# Altium project battery_shield.PrjPcb
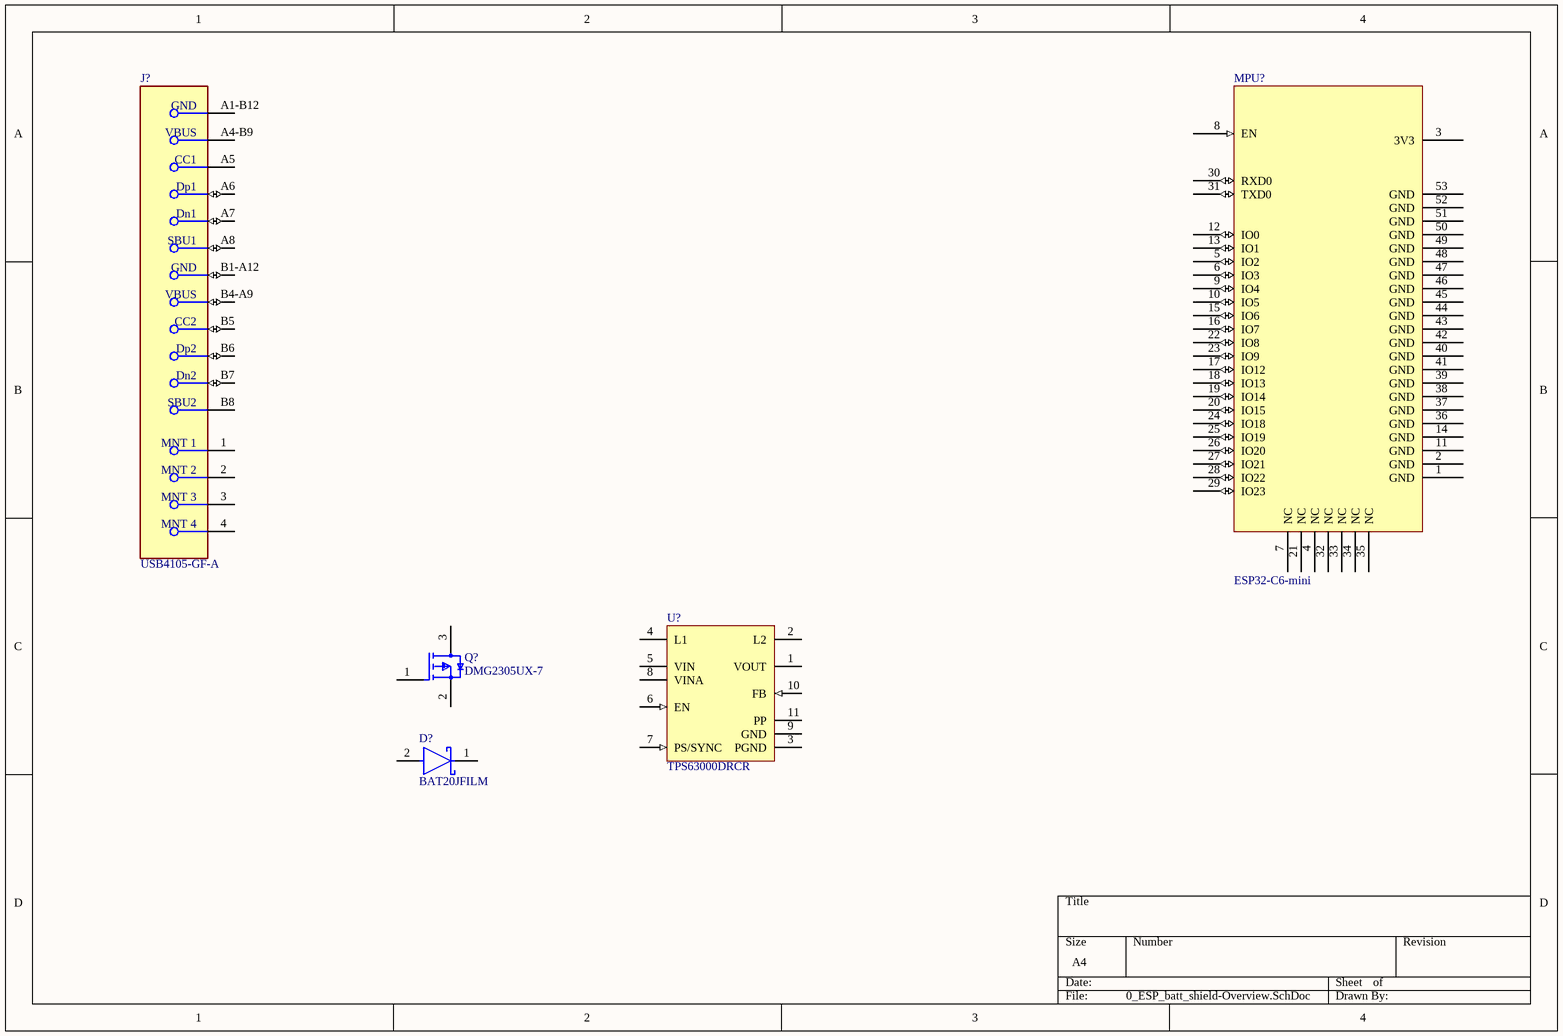
[diagram p0: 0_ESP_batt_shield-Overview.SchDoc]
3 sheets, 19 parts. Net scope: flat (ports and power ports of the same name join across sheets).
Board file: PCB1.PcbDoc
Sheets:
  0_ESP_batt_shield-Overview.SchDoc
  1_ESP_batt_shield-Power.SchDoc
  2_ESP_batt_shield-MCU_and_sensors.SchDoc

## Sheet 0_ESP_batt_shield-Overview.SchDoc
size A4; SheetNumber: 1; SheetTotal: 1

### Parts
(Parts that share a designator on the sheet are numbered #1, #2 ... from top to bottom, then left to right.)
D?  BAT20JFILM  [FP-BAT20JFILM-MFG]
J?  USB4105-GF-A  [FP-USB4105-GF-A-MFG]
MPU?#1  ESP32-C6-mini  [ESP32C6_MINI]
Q?  DMG2305UX-7  [FP-SOT23-IPC_B]
U?  TPS63000DRCR  [DRC0010J_V]

### Nets

Not connected (* = marked no-connect by the designer): D? 1(K) 2(A); J? 1(MNT_1) 2(MNT_2) 3(MNT_3) 4(MNT_4) A1-B12(GND) A4-B9(VBUS) A5(CC1) A6(Dp1) A7(Dn1) A8(SBU1) B1-A12(GND) B4-A9(VBUS) B5(CC2) B6(Dp2) B7(Dn2) B8(SBU2); MPU?#1 1(GND) 2(GND) 3(3V3) 4(NC) 5(IO2) 6(IO3) 7(NC) 8(EN) 9(IO4) 10(IO5) 11(GND) 12(IO0) 13(IO1) 14(GND) 15(IO6) 16(IO7) 17(IO12) 18(IO13) 19(IO14) 20(IO15) 21(NC) 22(IO8) 23(IO9) 24(IO18) 25(IO19) 26(IO20) 27(IO21) 28(IO22) 29(IO23) 30(RXD0) 31(TXD0) 32(NC) 33(NC) 34(NC) 35(NC) 36(GND) 37(GND) 38(GND) 39(GND) 40(GND) 41(GND) 42(GND) 43(GND) 44(GND) 45(GND) 46(GND) 47(GND) 48(GND) 49(GND) 50(GND) 51(GND) 52(GND) 53(GND); Q? 1(GATE) 2(SOURCE) 3(DRAIN); U? 1(VOUT) 2(L2) 3(PGND) 4(L1) 5(VIN) 6(EN) 7(PS/SYNC) 8(VINA) 9(GND) 10(FB) 11(PP)

### Library data of the parts
D? = CMP-12187-000030-1: DIODE SCHOTTKY 23V 1A SOD323; Polarity: Standard; Element Configuration: Single; Capacitance: 30pF; Forward Voltage: 620mV; Max Surge Current: 5A; Peak Reverse Current: 12uA; Packaging: Tape and Reel; Weight: 0.01lb; Output Current: 1A; Lead Free: Lead Free; Forward Current: 1A; Mount: Surface Mount; Max Reverse Voltage (DC): 23V; Average Rectified Current: 1A; Max Operating Temperature: 150°C; Max Forward Surge Current (Ifsm): 5A; REACH SVHC: No SVHC; Current Rating: 1A; Length: 1.8mm; Radiation Hardening: No; Max Reverse Leakage Current: 12uA; Voltage Rating (DC): 23V; Height: 1.03mm; Peak Non-Repetitive Surge Current: 5A; Max Repetitive Reverse Voltage (Vrrm): 23V; Min Operating Temperature: -65°C; Number of Pins: 2; Width: 1.35mm; Package Quantity: 1
J? = CMP-245163-000001-1: CONN RCPT USB2.0 TYPEC 5A; Manufacturer: GCT; Voltage Rating: 20V; Is Female: yes; Current Rating: 5/6.25/1.25/0.25A; Number Of Contacts: 16; Conn Orientation: Right Angle; Device Class L1: Connectors; Category: Conn; Lead Free: Yes; RoHS: TRUE; Temperature Range High: +85°C; Digikey Description: CONN RCPT USB2.0 TYPEC 5A; Device Class L3: unset; ComponentLink2Description: Datasheet; Manufacturer Part Number: USB4105-GF-A; Package: 0; Usb Standard: USB 2.0; Device Class L2: USB Connectors; Automotive: No; Temperature Range Low: -40°C; Height: 3.46mm; Temperature: -40°C to +85°C; Contact Material: Gold,Nickel; ComponentLink2URL: https://gct.co/files/drawings/usb4105.pdf; Octopart: https://octopart.com/usb4105-gf-a-gct-106627878
Q? = CMP-1693-00002-4: MOSFET P-CH 20V 4.2A SOT23; Turn-On Delay Time: 10.8ns; Turn-Off Delay Time: 79.3ns; Threshold Voltage: -900mV; Rise Time: 13.7ns; Gate to Source Voltage (Vgs): 8V; Rds On Max: 52mR; Element Configuration: Single; Fall Time: 34.7ns; Max Power Dissipation: 1.4W; Drain to Source Resistance: 200mR; Number of Channels: 1; Input Capacitance: 808pF; Lead Free: Lead Free; Number of Pins: 3; Length: 3mm; Continuous Drain Current (ID): 4.2A; Contact Plating: Tin; Mount: Surface Mount; Weight: 0.000282oz; Min Operating Temperature: -55°C; Package Quantity: 3000; Drain to Source Voltage (Vdss): 20V; On-State Resistance: 52MR; Max Operating Temperature: 150°C; Height: 1.1mm; REACH SVHC: No SVHC; Packaging: Tape and Reel; Radiation Hardening: No; Case/Package: SOT-23; Width: 1.4mm
U? = CMP-0345-00001-2: Buck-Boost Voltage Converter with 1.8 to 5.5 V Input and 1.2 to 5.5 V Output, -40 to 85 degC, 10-Pin SON (DRC), Green (RoHS & no Sb/Br); Manufacturer: Texas Instruments; Vout(Max)(V): 5.5; Synchronous Rectification: TRUE; SubFamily: Buck-Boost Regulator; Vin(Min)(V): 1.8; Iq(Typ)(mA): 0.04; Iout(Max)(A): 1.2; Regulated Outputs(#): 1; Switching Frequency(Max)(kHz): 1500; ComponentLink1Description: Datasheet; Mounting Technology: Surface Mount; DatasheetVersion: SLVS520B; Eco-Plan: Green (RoHS & no Sb/Br); PackageVersion: revL, Sep-2011; PackageDescription: 10-Pin Plastic Small Outline No-Lead, 3 x 3 x 1 mm Body, 0.5 mm Pitch, Exposed Pad; Vout(Min)(V): 1.2; Vin(Max)(V): 5.5; Topology: Buck-Boost; Dynamic Voltage Scaling: TRUE; ComponentLink1URL: http://www.ti.com/general/docs/lit/getliterature.tsp?genericPartNumber=TPS63000&fileType=pdf; PartNumber: TPS63000DRCR; ComponentLink2URL: http://www.ti.com/litv/pdf/mpds117k; PackageReference: DRC0010J; ComponentLink2Description: Package Specification

## Sheet 1_ESP_batt_shield-Power.SchDoc
size A4; SheetNumber: 2; SheetTotal: 3
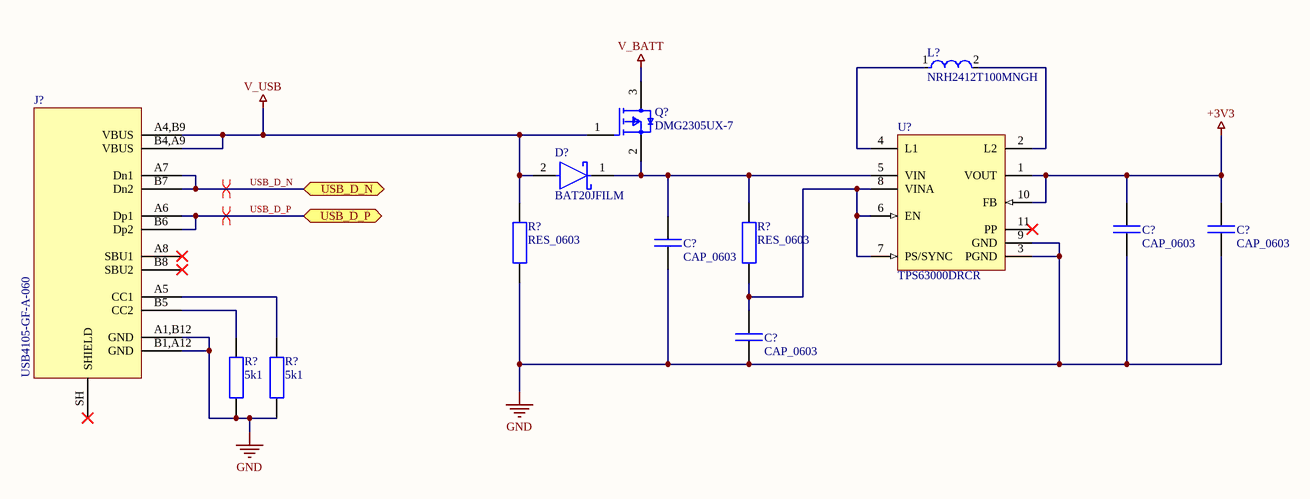
[diagram p1: 1_ESP_batt_shield-Power.SchDoc]

### Parts
C5  CAP_0603  [CAP_0603]
C6  CAP_0603  [CAP_0603]
C7  CAP_0603  [CAP_0603]
C8  CAP_0603  [CAP_0603]
D3  BAT20JFILM  [FP-BAT20JFILM-MFG]
J3  USB4105-GF-A-060  [GCT_USB4105-GF-A-060]
L1  NRH2412T100MNGH  [FP-NRH2412-MFG]
Q1  DMG2305UX-7  [FP-SOT23-IPC_B]
R2  RES_0603  [RES_0603]
R3  RES_0603  [RES_0603]
R4  5k1  [RES_0603]
R5  5k1  [RES_0603]
U1  TPS63000DRCR  [DRC0010J_V]

### Ports
USB_D_N (bidir), USB_D_P (bidir)

### Nets
+3V3: C5.2 C6.2 U1.1(VOUT) U1.10(FB)
GND: C5.1 C6.1 C7.1 C8.1 J3.A1,B12(GND) J3.B1,A12(GND) R2.1 R4.1 R5.1 U1.3(PGND) U1.9(GND)
V_BATT: Q1.3(DRAIN)
V_USB: D3.2(A) J3.A4,B9(VBUS) J3.B4,A9(VBUS) Q1.1(GATE) R2.2
USB_D_N: J3.A7(Dn1) J3.B7(Dn2) ; port USB_D_N
USB_D_P: J3.A6(Dp1) J3.B6(Dp2) ; port USB_D_P
NetC7_2: C7.2 D3.1(K) Q1.2(SOURCE) R3.2 U1.5(VIN)
NetC8_2: C8.2 R3.1 U1.6(EN) U1.7(PS/SYNC) U1.8(VINA)
NetJ3_A5: J3.A5(CC1) R5.2
NetJ3_B5: J3.B5(CC2) R4.2
NetL1_1: L1.1 U1.4(L1)
NetL1_2: L1.2 U1.2(L2)

Not connected (* = marked no-connect by the designer): J3 A8(SBU1)* B8(SBU2)* SH(SHIELD)*; U1 11(PP)*

### Layout directives
differential pair: USB_D_N, USB_D_P

### Notes on the sheet
- (in symbol USB4105-GF-A-060) USB-C connector

### Library data of the parts
D3 = CMP-12187-000030-1: as D? on sheet 0_ESP_batt_shield-Overview; Packaging: Tape and Reel; Weight: 0.01lb; Output Current: 1A; Lead Free: Lead Free; Forward Current: 1A; Mount: Surface Mount; Max Reverse Voltage (DC): 23V; Average Rectified Current: 1A; Max Operating Temperature: 150°C; Max Forward Surge Current (Ifsm): 5A; REACH SVHC: No SVHC; Current Rating: 1A; Length: 1.8mm; Radiation Hardening: No; Max Reverse Leakage Current: 12uA; Voltage Rating (DC): 23V; Height: 1.03mm; Peak Non-Repetitive Surge Current: 5A; Max Repetitive Reverse Voltage (Vrrm): 23V; Min Operating Temperature: -65°C; Number of Pins: 2; Width: 1.35mm; Package Quantity: 1
J3 = USB4105-GF-A-060: This is 16pin USB-C connector; pin to pad: A1,B12>A1_B12 A4,B9>A4_B9 B1,A12>B1_A12 B4,A9>B4_A9
L1 = CMP-14484-000582-1: Shielded Wirewound Inductor 10uH 20% 0.51A 0.72Ω SMD; DC Resistance (DCR): 600mR; Current Rating: 450mA; Saturation Current: 810mA; Core Material: Ferrite; Test Frequency: 100kHz; Self Resonant Frequency: 29MHz; Termination: SMD/SMT; Shielding: Shielded; Height - Seated (Max): 0.047inch; Case/Package: Nonstandard; Tolerance: 20%; Height: 1.2mm; Package Quantity: 2500; Mount: Surface Mount; Min Operating Temperature: -25°C; Inductance: 10uH; Width: 0.095inch; Length: 0.095inch; RoHS Compliant: Yes; Max DC Current: 810mA; Packaging: Tape and Reel; Max Operating Temperature: 120°C; Halogen Free: Halogen Free
Q1 = CMP-1693-00002-4: as Q? on sheet 0_ESP_batt_shield-Overview; Lead Free: Lead Free; Number of Pins: 3; Length: 3mm; Continuous Drain Current (ID): 4.2A; Contact Plating: Tin; Mount: Surface Mount; Weight: 0.000282oz; Min Operating Temperature: -55°C; Package Quantity: 3000; Drain to Source Voltage (Vdss): 20V; On-State Resistance: 52MR; Max Operating Temperature: 150°C; Height: 1.1mm; REACH SVHC: No SVHC; Packaging: Tape and Reel; Radiation Hardening: No; Case/Package: SOT-23; Width: 1.4mm
R4 R5 = RES_0603
U1 = CMP-0345-00001-2: as U? on sheet 0_ESP_batt_shield-Overview; ComponentLink1Description: Datasheet; Mounting Technology: Surface Mount; DatasheetVersion: SLVS520B; Eco-Plan: Green (RoHS & no Sb/Br); PackageVersion: revL, Sep-2011; PackageDescription: 10-Pin Plastic Small Outline No-Lead, 3 x 3 x 1 mm Body, 0.5 mm Pitch, Exposed Pad; Vout(Min)(V): 1.2; Vin(Max)(V): 5.5; Topology: Buck-Boost; Dynamic Voltage Scaling: TRUE; ComponentLink1URL: http://www.ti.com/general/docs/lit/getliterature.tsp?genericPartNumber=TPS63000&fileType=pdf; PartNumber: TPS63000DRCR; ComponentLink2URL: http://www.ti.com/litv/pdf/mpds117k; PackageReference: DRC0010J; ComponentLink2Description: Package Specification

## Sheet 2_ESP_batt_shield-MCU_and_sensors.SchDoc
size A4; SheetNumber: 3; SheetTotal: 3
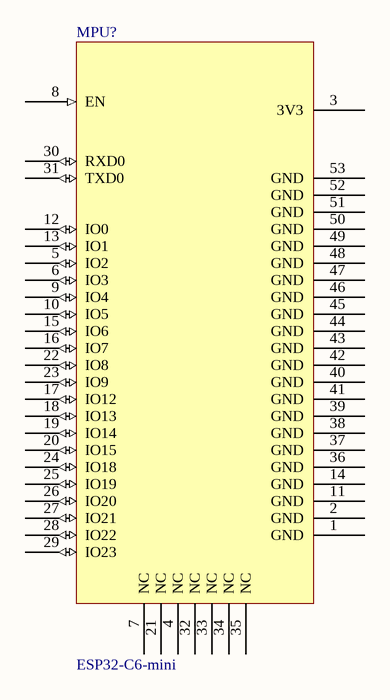
[diagram p2: 2_ESP_batt_shield-MCU_and_sensors.SchDoc]

### Parts
(Parts that share a designator on the sheet are numbered #1, #2 ... from top to bottom, then left to right.)
MPU?#2  ESP32-C6-mini  [ESP32C6_MINI]

### Nets

Not connected (* = marked no-connect by the designer): MPU?#2 1(GND) 2(GND) 3(3V3) 4(NC) 5(IO2) 6(IO3) 7(NC) 8(EN) 9(IO4) 10(IO5) 11(GND) 12(IO0) 13(IO1) 14(GND) 15(IO6) 16(IO7) 17(IO12) 18(IO13) 19(IO14) 20(IO15) 21(NC) 22(IO8) 23(IO9) 24(IO18) 25(IO19) 26(IO20) 27(IO21) 28(IO22) 29(IO23) 30(RXD0) 31(TXD0) 32(NC) 33(NC) 34(NC) 35(NC) 36(GND) 37(GND) 38(GND) 39(GND) 40(GND) 41(GND) 42(GND) 43(GND) 44(GND) 45(GND) 46(GND) 47(GND) 48(GND) 49(GND) 50(GND) 51(GND) 52(GND) 53(GND)